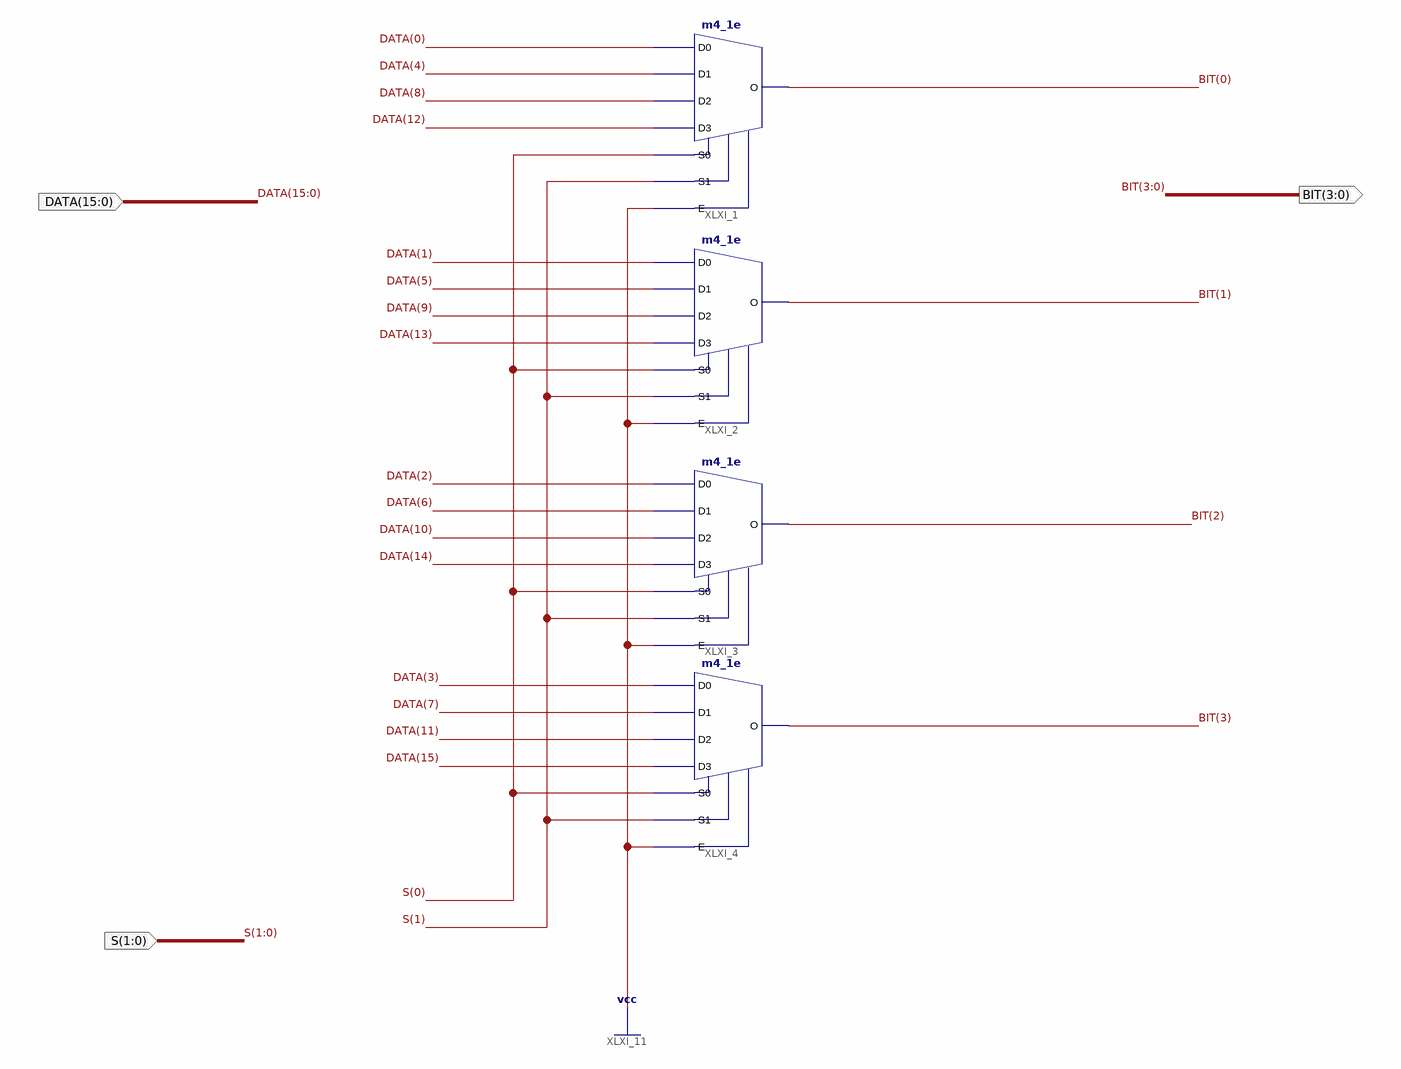
[diagram p0: schematic sheet 1]
// Xilinx ISE schematic MULTIPLEXER_4Bits.sch (spartan6) as structural Verilog: 4 symbols, 3 ports
module MULTIPLEXER_4Bits (
  input  [15:0] DATA,
  input  [1:0] S,
  output [3:0] BIT
);

  m4_1e XLXI_1 (.D0(DATA[0]), .D1(DATA[4]), .D2(DATA[8]), .D3(DATA[12]), .E(1'b1), .S0(S[0]), .S1(S[1]), .O(BIT[0]));
  m4_1e XLXI_2 (.D0(DATA[1]), .D1(DATA[5]), .D2(DATA[9]), .D3(DATA[13]), .E(1'b1), .S0(S[0]), .S1(S[1]), .O(BIT[1]));
  m4_1e XLXI_3 (.D0(DATA[2]), .D1(DATA[6]), .D2(DATA[10]), .D3(DATA[14]), .E(1'b1), .S0(S[0]), .S1(S[1]), .O(BIT[2]));
  m4_1e XLXI_4 (.D0(DATA[3]), .D1(DATA[7]), .D2(DATA[11]), .D3(DATA[15]), .E(1'b1), .S0(S[0]), .S1(S[1]), .O(BIT[3]));
endmodule
